# Altium schematic sheet МПСУ.464342.21-005 Э3 Лист3.SchDoc
size 297 x 209 mm; Address1: Address1; Address2: Address2; Address3: Address3; Address4: Address4; SheetNumber: 4; SheetTotal: 5; Scale: 1:1; Обозначение документа: МПСУ.464342.21-005 Э3
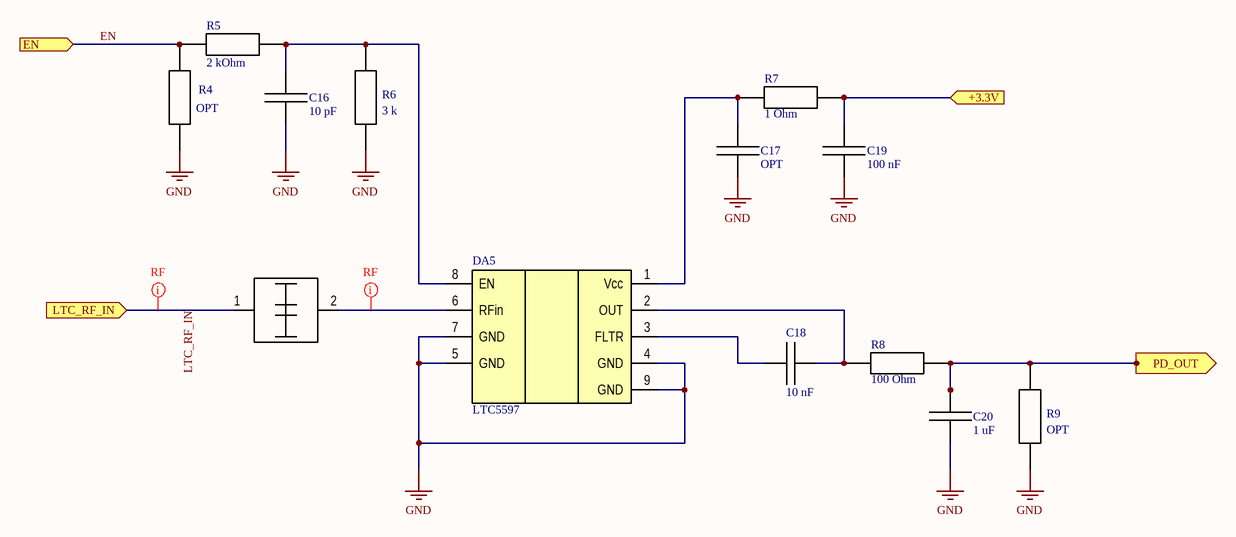
[diagram p0: МПСУ.464342.21-005 Э3 Лист3.SchDoc]

## Parts
C16  10 pF  [CAPC100X50X55L20N]
C17  OPT  [CAPC100X50X55L20N]
C18  10 nF  [CAPC100X50X55L20N]
C19  100 nF  [CAPC100X50X55L20N]
C20  1 uF  [CAPC100X50X55L20N]
DA5  LTC5597  [LTC5597]
R4  OPT  [RESC100X50X40L25N]
R5  2 kOhm  [RESC100X50X40L25N]
R6  3 k  [RESC100X50X40L25N]
R7  1 Ohm  [RESC100X50X40L25N]
R8  100 Ohm  [RESC100X50X40L25N]
R9  OPT  [RESC100X50X40L25N]
W6  Matching  [MATCHING_LTC_IN]  (value not drawn)  (net tie, no BOM)

## Ports
+3.3V (in), EN (in), LTC_RF_IN (in), PD_OUT (out)

## Nets
GND: C16.1 C17.1 C19.1 C20.1 DA5.4(GND) DA5.5(GND) DA5.7(GND) DA5.9(GND) R4.1 R6.1 R9.1
+3.3V: C19.2 R7.2 ; port +3.3V
EN: R4.2 R5.1 ; port EN
LTC_RF_IN: W6.1 ; port LTC_RF_IN
PD_OUT: C20.2 R8.2 R9.2 ; port PD_OUT
NetC16_2: C16.2 DA5.8(EN) R5.2 R6.2
NetC17_2: C17.2 DA5.1(Vcc) R7.1
NetC18_1: C18.1 DA5.3(FLTR)
NetC18_2: C18.2 DA5.2(OUT) R8.1
NetDA5_6: DA5.6(RFin) W6.2

## Layout directives
net class RF: LTC_RF_IN, NetDA5_6

## Notes on the sheet
- Подп. и дата
- Инв. № дубл.
- Взам. инв. №
- Инв. № подл.
- Изм.
- Лист
- № докум.
- Подп.
- Дата
- Копировал
- Формат А4

## Library data of the parts
C16-C20 = Capacitor: Capacitor, generic; Value: 100 pF; PartNumber: *; Tolerance: *; VDC: *; Dielectric: *; Manufacturer: *; Package: 0402
DA5 = LTC5597: 100MHz to 70GHz Linear-in-dB RMS Power Detector with 35dB Dynamic Range; Manufacturer: Analog Devices; PartNumber: LTC5597; ComponentLink1Description: Product Page; ComponentLink1URL: https://www.analog.com/en/products/ltc5597.html#product-overview
R4-R9 = Resistor: Resistor, generic; Value: 10; PartNumber: *; Tolerance: *; Power: *; DCV: *; Manufacturer: *; Package: 0402
W6 = Matching_1